# Altium schematic sheet Expansion.SchDoc: Expansion
size A4; SheetNumber: 3; SheetSize: A4
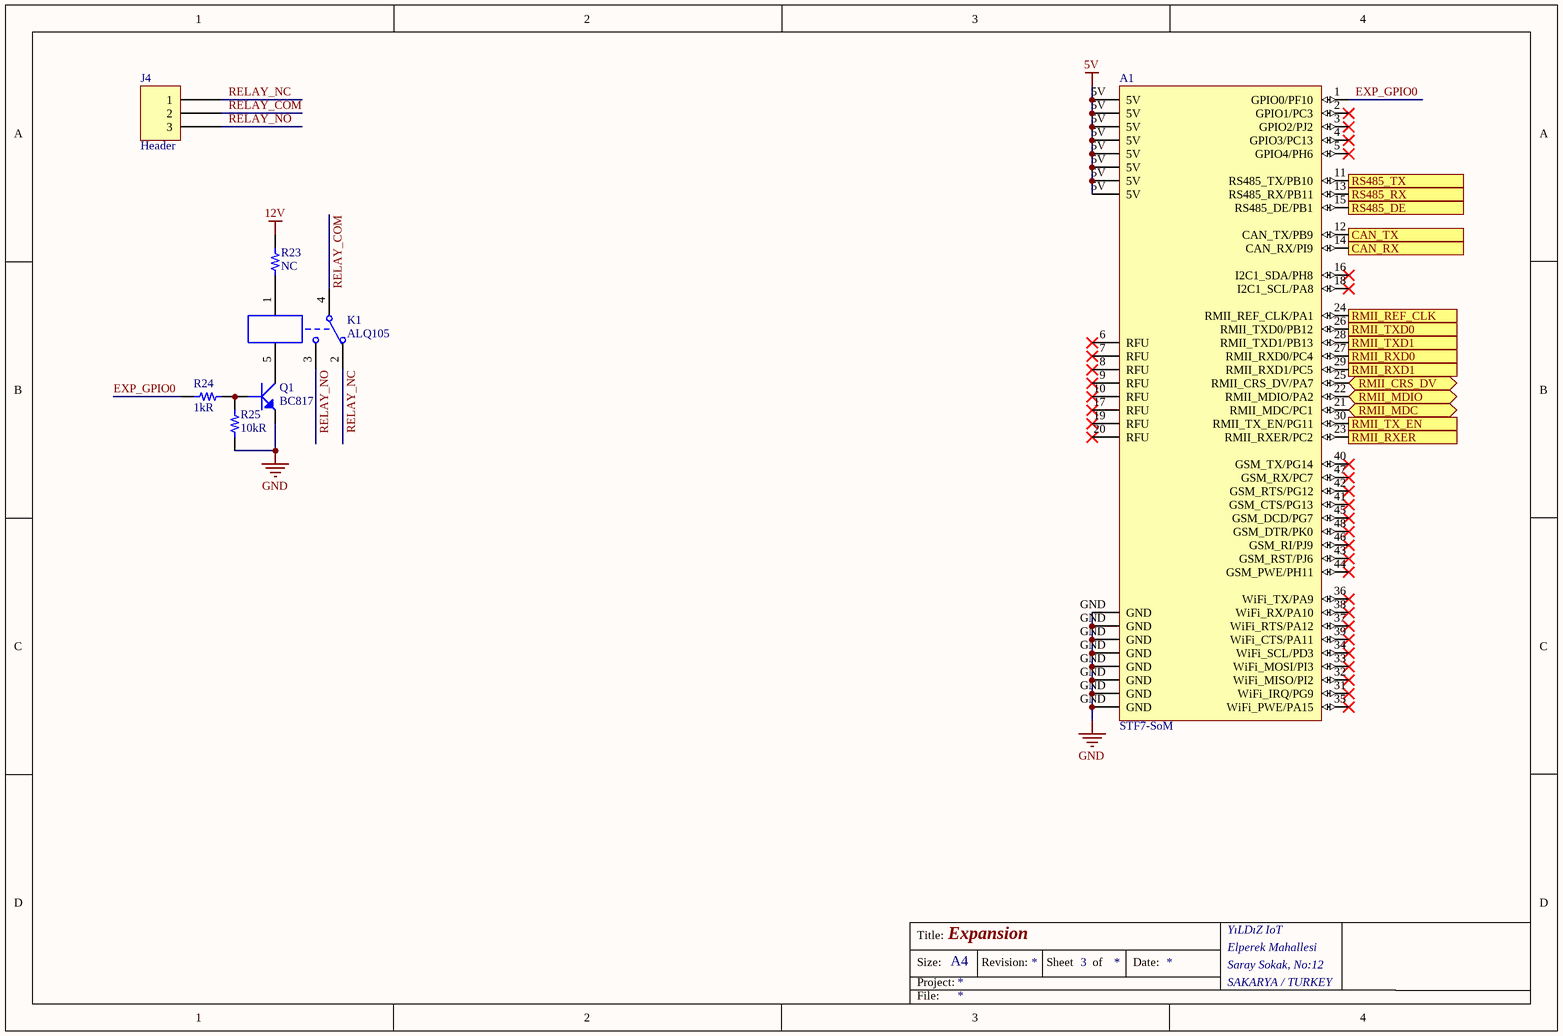
[diagram p0: Expansion.SchDoc]

## Parts
A1  STF7-SoM  [STF7-SoM]
J4  Header  [TE 282834-3]  (no BOM)
K1  ALQ105  [ALQ105]
Q1  BC817  [SOT23-3]  (no BOM)
R23  NC  [RES 0603/1608]  (no BOM)
R24  1kR  [RES 0603/1608]
R25  10kR  [RES 0603/1608]

## Ports
CAN_RX (in), CAN_TX (out), RMII_CRS_DV (bidir), RMII_MDC (bidir), RMII_MDIO (bidir), RMII_REF_CLK (in), RMII_RXD0 (out), RMII_RXD1 (out), RMII_RXER (out), RMII_TX_EN (in), RMII_TXD0 (in), RMII_TXD1 (in), RS485_DE (out), RS485_RX (in), RS485_TX (out)

## Nets
5V: A1.5V
12V: R23.2
GND: A1.GND Q1.2(E) R25.2
CAN_RX: A1.14(CAN_RX/PI9) ; port CAN_RX
CAN_TX: A1.12(CAN_TX/PB9) ; port CAN_TX
EXP_GPIO0: A1.1(GPIO0/PF10) R24.2
RELAY_COM: J4.2 K1.4(COM)
RELAY_NC: J4.1 K1.2(NC)
RELAY_NO: J4.3 K1.3(NO)
RMII_CRS_DV: A1.25(RMII_CRS_DV/PA7) ; port RMII_CRS_DV
RMII_MDC: A1.21(RMII_MDC/PC1) ; port RMII_MDC
RMII_MDIO: A1.22(RMII_MDIO/PA2) ; port RMII_MDIO
RMII_REF_CLK: A1.24(RMII_REF_CLK/PA1) ; port RMII_REF_CLK
RMII_RXD0: A1.27(RMII_RXD0/PC4) ; port RMII_RXD0
RMII_RXD1: A1.29(RMII_RXD1/PC5) ; port RMII_RXD1
RMII_RXER: A1.23(RMII_RXER/PC2) ; port RMII_RXER
RMII_TX_EN: A1.30(RMII_TX_EN/PG11) ; port RMII_TX_EN
RMII_TXD0: A1.26(RMII_TXD0/PB12) ; port RMII_TXD0
RMII_TXD1: A1.28(RMII_TXD1/PB13) ; port RMII_TXD1
RS485_DE: A1.15(RS485_DE/PB1) ; port RS485_DE
RS485_RX: A1.13(RS485_RX/PB11) ; port RS485_RX
RS485_TX: A1.11(RS485_TX/PB10) ; port RS485_TX
NetK1_1: K1.1(COIL) R23.1
NetK1_5: K1.5(COIL) Q1.3(C)
NetQ1_1: Q1.1(B) R24.1 R25.1

Not connected (* = marked no-connect by the designer): A1 2(GPIO1/PC3)* 3(GPIO2/PJ2)* 4(GPIO3/PC13)* 5(GPIO4/PH6)* 6(RFU)* 7(RFU)* 8(RFU)* 9(RFU)* 10(RFU)* 16(I2C1_SDA/PH8)* 17(RFU)* 18(I2C1_SCL/PA8)* 19(RFU)* 20(RFU)* 31(WiFi_IRQ/PG9)* 32(WiFi_MISO/PI2)* 33(WiFi_MOSI/PI3)* 34(WiFi_SCL/PD3)* 35(WiFi_PWE/PA15)* 36(WiFi_TX/PA9)* 37(WiFi_RTS/PA12)* 38(WiFi_RX/PA10)* 39(WiFi_CTS/PA11)* 40(GSM_TX/PG14)* 41(GSM_CTS/PG13)* 42(GSM_RTS/PG12)* 43(GSM_RST/PJ6)* 44(GSM_PWE/PH11)* 45(GSM_DCD/PG7)* 46(GSM_RI/PJ9)* 47(GSM_RX/PC7)* 48(GSM_DTR/PK0)*

## Notes on the sheet
- Title:
- Size:
- Project:
- Revision:
- Sheet
- of
- Date:
- YıLDıZ IoT
- Elperek Mahallesi
- Saray Sokak, No:12
- SAKARYA / TURKEY
- File:

## Library data of the parts
A1 = STF7-SoM: STM32F7 System On Module; Manufacturer Part Number: STF7-SoM
J4 = 3 Pin
K1 = Relay SPDT: Relay or Contactor; Manufacturer: Panasonic; Coil Voltage (DC): 5V; Coil Type: Non-Latching; Relay Type: General Purpose; Throw Configuration: SPDT; Coil Resistance: 62.5R; Coil Current: 80mA; Operate Time: 20ms; Coil Power: 400mW; Max Voltage Rating (AC): 250V; Contact Current Rating: 10A; Supplier 1: Digi-Key; Supplier Part Number 1: 255-3565-ND; Manufacturer Part Number: ALQ105; Stock 1: 8117; Pricing 1: 1 = 1,22000, 10 = 1,14800, 25 = 1,02000, 50 = 0,96900, 100 = 0,91800, 250 = 0,81600, 500 = 0,76500, 1000 = 0,71400, 5000 = 0,68850 (USD); RoHS: Yes; Number of Pins: 5; Weight: 7g; Contact Material: Silver; Min Operating Temperature: -40°C; Max Operating Temperature: 85°C; Termination: PC Pin; Release Time: 20ms; Package Quantity: 100; Packaging: Carton; Power Rating: 400mW; Power Consumption: 400mW; Voltage Rating (AC): 250V; Length: 20mm; Height: 16mm; Depth: 10mm; Width: 10mm; Lead Free: Lead Free; REACH SVHC: Unknown; ComponentLink1URL: http://www.mouser.com/ds/2/315/lq-catalog-1075796.pdf?src-supplier=Mouser; ComponentLink1Description: http://www.mouser.com/ds/2/315/lq-catalog-1075796.pdf?src-supplier=Mouser; ComponentLink2URL: http://www.farnell.com/datasheets/2245159.pdf?src-supplier=Farnell; ComponentLink2Description: http://www.farnell.com/datasheets/2245159.pdf?src-supplier=Farnell; ComponentLink3URL: http://components.arrow.com/part/dataview/0323_06571492?src-supplier=Arrow+Europe; ComponentLink3Description: http://components.arrow.com/part/dataview/0323_06571492?src-supplier=Arrow+Europe; ComponentLink4URL: http://www.alliedelec.com/m/d/b3e6213128df2023f710f2e9cac83292.pdf?src-supplier=Allied+Electronics; ComponentLink4Description: http://www.alliedelec.com/m/d/b3e6213128df2023f710f2e9cac83292.pdf?src-supplier=Allied+Electronics; ComponentLink5URL: https://media.digikey.com/pdf/Data%20Sheets/Panasonic%20Electric%20Works%20PDFs/ALQ(LQ)Relays_NewProdIntro.pdf?src-supplier=Digi-Key; ComponentLink5Description: https://media.digikey.com/pdf/Data%20Sheets/Panasonic%20Electric%20Works%20PDFs/ALQ(LQ)Relays_NewProdIntro.pdf?src-supplier=Digi-Key; ComponentLink6URL: http://www.farnell.com/datasheets/1972641.pdf?src-supplier=Element14; ComponentLink6Description: http://www.farnell.com/datasheets/1972641.pdf?src-supplier=Element14; ComponentLink7URL: http://www.farnell.com/datasheets/2245159.pdf?src-supplier=Newark; ComponentLink7Description: http://www.farnell.com/datasheets/2245159.pdf?src-supplier=Newark
Q1 = BC817: Transistor, BC817; Manufacturer: ON Semiconductor; Manufacturer Part Number: BC817-16LT1G; Transistor Type: NPN; Vce Saturation (Max) @ Ib, Ic: 700mV @ 50mA, 500mA; Current - Collector Cutoff (Max): 100nA (ICBO); DC Current Gain (hFE) (Min) @ Ic, Vce: 100 @ 100mA, 1V; Frequency - Transition: 100MHz; Supplier 1: Digi-Key; Supplier Part Number 1: BC817-16LT1GOSCT-ND; RoHS: RoHS Compliant; Category: Discrete Semiconductor Products; Stock 1: 46603; Pricing 1: 1=0.13, 10=0.118, 100=0.0642, 500=0.0395, 1000=0.02693 (USD); Packaging: Cut Tape (CT); Part Status: Active; Operating Temperature: -65°C ~ 150°C (TJ); Mounting Type: Surface Mount; Package / Case: TO-236-3, SC-59, SOT-23-3; Supplier Device Package: SOT-23-3 (TO-236); Base Part Number: BC817; ComponentLink1URL: http://www.onsemi.com/pub/Collateral/BC817-16LT1-D.PDF; ComponentLink1Description: http://www.onsemi.com/pub/Collateral/BC817-16LT1-D.PDF; Price: 0,13
R23 = Resistor_Chip: Ceramic, SMT Capacitor; Resistance: NC
R24 = Resistor_Chip: Ceramic, SMT Capacitor; Manufacturer: Rohm; Manufacturer Part Number: ESR03EZPJ102; Tolerance: 5%; Temperature Coefficient: 200ppm/°C; Max Power Dissipation: 250mW; Supplier 1: Digi-Key; Supplier Part Number 1: RHM1.0KDCT-ND; Stock 1: 148117; Pricing 1: 1 = 0,10000, 10 = 0,08300, 100 = 0,03180, 1000 = 0,01398, 2500 = 0,01207 (USD); RoHS: Yes; Case/Package: 0603; Case Code (Metric): 1608; Case Code (Imperial): 0603; Min Operating Temperature: -55°C; Max Operating Temperature: 155°C; Resistance: 1kR; Package Quantity: 1; Packaging: Tape and Reel; Composition: Thick Film; Number of Terminations: 2; Features: Automotive AEC-Q200; Length: 0.063inch; Height: 0.022inch; Width: 0.031inch; Lead Free: Lead Free; ComponentLink1URL: https://datasheet.ciiva.com/2469/esr-2469603.pdf?src-supplier=Digi-Key; ComponentLink1Description: https://datasheet.ciiva.com/2469/esr-2469603.pdf?src-supplier=Digi-Key; ComponentLink2URL: https://datasheet.ciiva.com/2469/esr-2469604.pdf?src-supplier=Digi-Key; ComponentLink2Description: https://datasheet.ciiva.com/2469/esr-2469604.pdf?src-supplier=Digi-Key; ComponentLink3URL: https://datasheet.ciiva.com/2469/esr-2469605.pdf?src-supplier=Digi-Key; ComponentLink3Description: https://datasheet.ciiva.com/2469/esr-2469605.pdf?src-supplier=Digi-Key
R25 = Resistor_Chip: Ceramic, SMT Capacitor; Manufacturer: Stackpole Electronics; Manufacturer Part Number: RNCP0603FTD10K0; Tolerance: 1%; Max Power Dissipation: 125mW; Temperature Coefficient: 100ppm/°C; Supplier 1: Digi-Key; Supplier Part Number 1: RNCP0603FTD10K0CT-ND; Stock 1: 183083; Pricing 1: 1 = 0,10000, 10 = 0,06700, 100 = 0,02730, 1000 = 0,01224, 2500 = 0,01063 (USD); RoHS: Yes; Mount: Surface Mount; Case/Package: 0603; Case Code (Metric): 1608; Case Code (Imperial): 0603; Contact Plating: Matte,Tin; Min Operating Temperature: -55°C; Max Operating Temperature: 155°C; Packaging: Tape and Reel; Resistance: 10kR; Composition: Thin Film; Number of Terminations: 2; Features: Anti-Sulfur,Moisture Resistant; Length: 0.059inch; Height: 0.02inch; Width: 0.031inch; Radiation Hardening: No; Lead Free: Lead Free